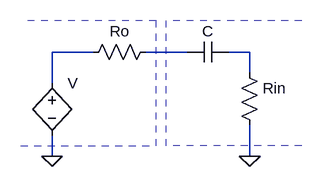
[diagram p0: schematic circuito_1.asc]
circuito_1.asc, the LTspice schematic file:
Version 4
SHEET 1 880 680
WIRE 80 96 16 96
WIRE 224 96 160 96
WIRE 320 96 288 96
WIRE 320 128 320 96
WIRE 16 144 16 96
WIRE 16 256 16 224
WIRE 320 256 320 208
FLAG 16 256 0
FLAG 320 256 0
SYMBOL res 64 112 R270
WINDOW 0 32 56 VTop 2
WINDOW 3 0 56 VBottom 2
SYMATTR InstName Ro
SYMATTR Value ""
SYMBOL res 304 112 R0
SYMATTR InstName Rin
SYMATTR Value ""
SYMBOL cap 224 112 R270
WINDOW 0 32 32 VTop 2
WINDOW 3 0 32 VBottom 2
SYMATTR InstName C
SYMATTR Value ""
SYMBOL bv 16 128 R0
SYMATTR InstName V
SYMATTR Value ""
LINE Normal 176 48 -32 48 3
LINE Normal 176 240 176 48 3
LINE Normal -32 240 176 240 3
LINE Normal 192 240 192 48 3
LINE Normal 400 240 192 240 3
LINE Normal 400 48 192 48 3
LINE Normal 400 48 400 48 3

The netlist it stands for:
* circuito_1.asc
Ro N001 N002
Rin N003 0
C N002 N003
B§V N001 0
.backanno
.end